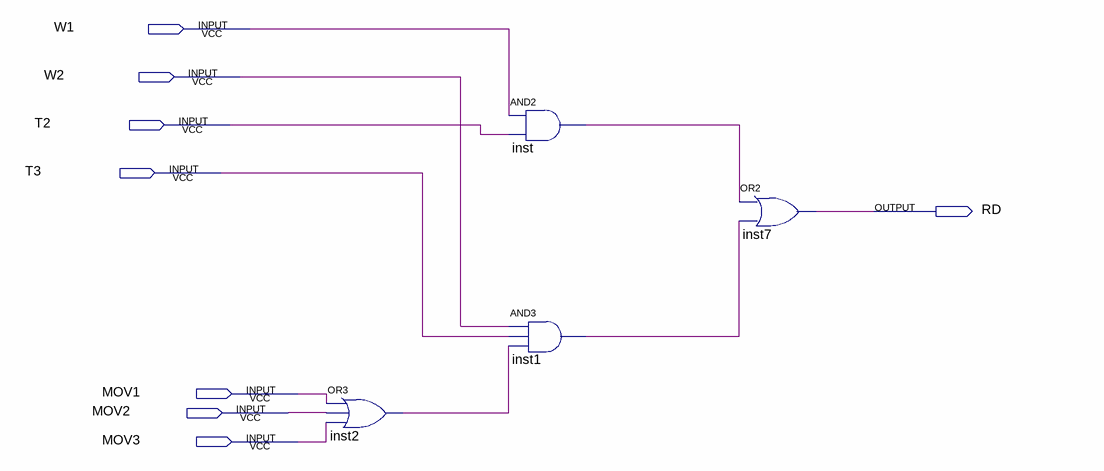
[diagram p0: schematic sheet]
// Quartus schematic RD.bdf as structural Verilog: 4 symbols, 8 pins
module RD (
  input  W1,
  input  W2,
  input  T2,
  input  T3,
  input  MOV1,
  input  MOV2,
  input  MOV3,
  output RD
);

  wire inst1_out, inst2_out, inst_out;

  or inst2 (inst2_out, MOV1, MOV2, MOV3);
  and inst (inst_out, W1, T2);
  and inst1 (inst1_out, W2, T3, inst2_out);
  or inst7 (RD, inst_out, inst1_out);
endmodule
